# Altium schematic sheet reefpi_pico_analog_out.SchDoc: reef-pi Pico Analog Output
size A4; DocumentNumber: 6; Revision: B; SheetNumber: 6; SheetTotal: 8
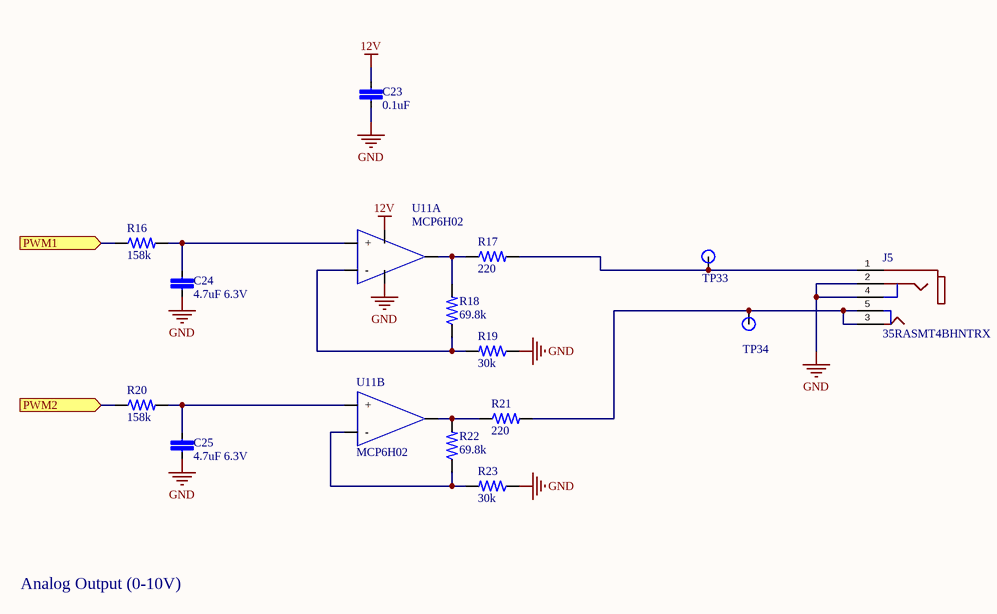
[diagram p0: reefpi_pico_analog_out.SchDoc]

## Parts
C23  0.1uF  [C0603]
C24  4.7uF 6.3V  [C0603]
C25  4.7uF 6.3V  [C0603]
J5  35RASMT4BHNTRX  [35RASMT4BHNTRX]
R16  158k  [R0603]
R17  220  [R0603]
R18  69.8k  [R0603]
R19  30k  [R0603]
R20  158k  [R0603]
R21  220  [R0603]
R22  69.8k  [R0603]
R23  30k  [R0603]
TP33  TP  [TP_0.89mm]  (value not drawn)
TP34  TP  [TP_0.89mm]  (value not drawn)
U11  MCP6H02  [SO-08]  (parts A,B of 2)

## Ports
PWM1 (in), PWM2 (in)

## Nets
12V: C23.1 U11.8(Vdd)
GND: C23.2 C24.2 C25.2 J5.2(MID) J5.4(MID) R19.1 R23.1 U11.4(GND)
PWM1: R16.1 ; port PWM1
PWM2: R20.1 ; port PWM2
NetC24_1: C24.1 R16.2 U11.3(+)
NetC25_1: C25.1 R20.2 U11.5(+)
NetJ5_1: J5.1(OUTER) R17.2 TP33.1
NetJ5_3: J5.3(TIP) J5.5(MID) R21.2 TP34.1
NetR17_1: R17.1 R18.2 U11.1(OUTA)
NetR18_1: R18.1 R19.2 U11.2(-)
NetR21_1: R21.1 R22.2 U11.7(OUTB)
NetR22_1: R22.1 R23.2 U11.6(-)

## Notes on the sheet
- Analog Output (0-10V)
- Title
- Size:
- Date:
- A4
- Number:
- Time:
- Revision:
- Sheet
- of
- github.com/blueacro
- blueacro.com
- CERN OHL v1.2
- Made available under the
- File:
- © 2018 StackFoundry LLC. All Rights Reserved.

## Library data of the parts
C23-C25 = C-EU
R16-R23 = R-US
U11 = MCP6H02: Supplier 1: Digi-Key